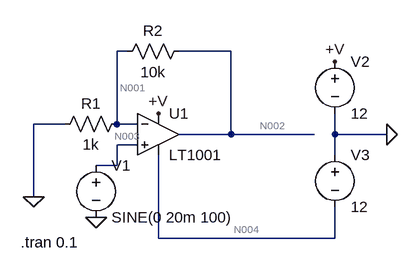
[diagram p0: schematic non inverting amp dependent onli on resistor.asc]
non inverting amp dependent onli on resistor.asc, the LTspice schematic file:
Version 4
SHEET 1 880 680
WIRE 112 48 96 48
WIRE 272 48 192 48
WIRE 16 160 -32 160
WIRE 96 160 96 48
WIRE 128 160 96 160
WIRE 272 176 272 48
WIRE 272 176 192 176
WIRE 400 176 272 176
WIRE 432 176 432 144
WIRE 512 176 432 176
WIRE 128 192 96 192
WIRE 432 208 432 176
WIRE 96 224 96 192
WIRE 96 224 64 224
WIRE -32 272 -32 160
WIRE 160 336 160 208
WIRE 432 336 432 288
WIRE 432 336 160 336
FLAG -32 272 0
FLAG 64 304 0
FLAG 160 144 +V
FLAG 432 64 +V
FLAG 512 176 0
SYMBOL Opamps\\LT1001 160 112 R0
SYMATTR InstName U1
SYMBOL res 112 144 R90
WINDOW 0 0 56 VBottom 2
WINDOW 3 32 56 VTop 2
SYMATTR InstName R1
SYMATTR Value 1k
SYMBOL res 208 32 R90
WINDOW 0 0 56 VBottom 2
WINDOW 3 32 56 VTop 2
SYMATTR InstName R2
SYMATTR Value 10k
SYMBOL voltage 64 208 R0
WINDOW 123 0 0 Left 2
WINDOW 39 0 0 Left 2
SYMATTR InstName V1
SYMATTR Value SINE(0 20m 100)
SYMBOL voltage 432 48 R0
SYMATTR InstName V2
SYMATTR Value 12
SYMBOL voltage 432 192 R0
SYMATTR InstName V3
SYMATTR Value 12
TEXT -52 342 Left 2 !.tran 0.1

The netlist it stands for:
* non inverting amp dependent onli on resistor.asc
XU1 N003 N001 +V N004 N002 LT1001  ; pins In+ In- V+ V- OUT
R1 N001 0 1k
R2 N002 N001 10k
V1 N003 0 SINE(0 20m 100)
V2 +V 0 12
V3 0 N004 12
.tran 0.1
.lib LTC.lib
.backanno
.end

* Results of the author's LTspice run, read from the files saved beside the schematic
* Operating Point, zero values left out:
*   V(+v) = 12 V
*   V(n004) = -12 V
*   I(V3) = -2.25 mA
*   I(V2) = -2.25 mA
*   Ix(u1:3) = 2.25 mA
*   Ix(u1:4) = -2.25 mA
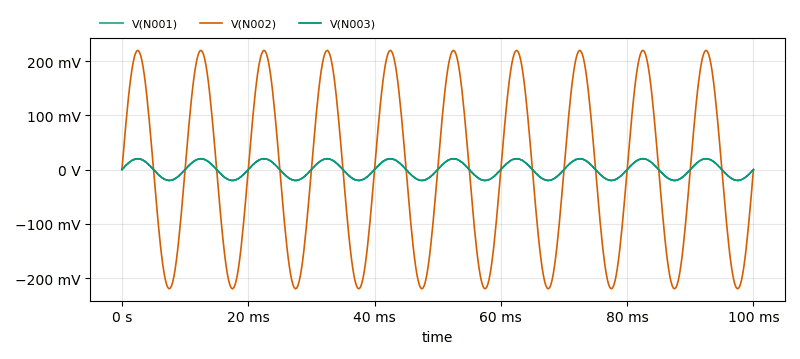
[diagram p1: Transient Analysis of non inverting amp dependent onli on resistor.asc, plotted from the saved traces]
* Transient Analysis, 1 run:
*   V(N001): min -19.98 mV, max 19.98 mV, average -3.413 nV, rms 14.13 mV, last -25.88 µV
*   V(N002): min -219.8 mV, max 219.8 mV, average -37.76 nV, rms 155.4 mV, last -284.5 µV
*   V(N003): min -19.98 mV, max 19.98 mV, average -4.525 nV, rms 14.13 mV, last 0 V